# EAGLE schematic Fuel Cell Controller V2 (EAGLE 7.7.0)

## Sheet 1 of 7
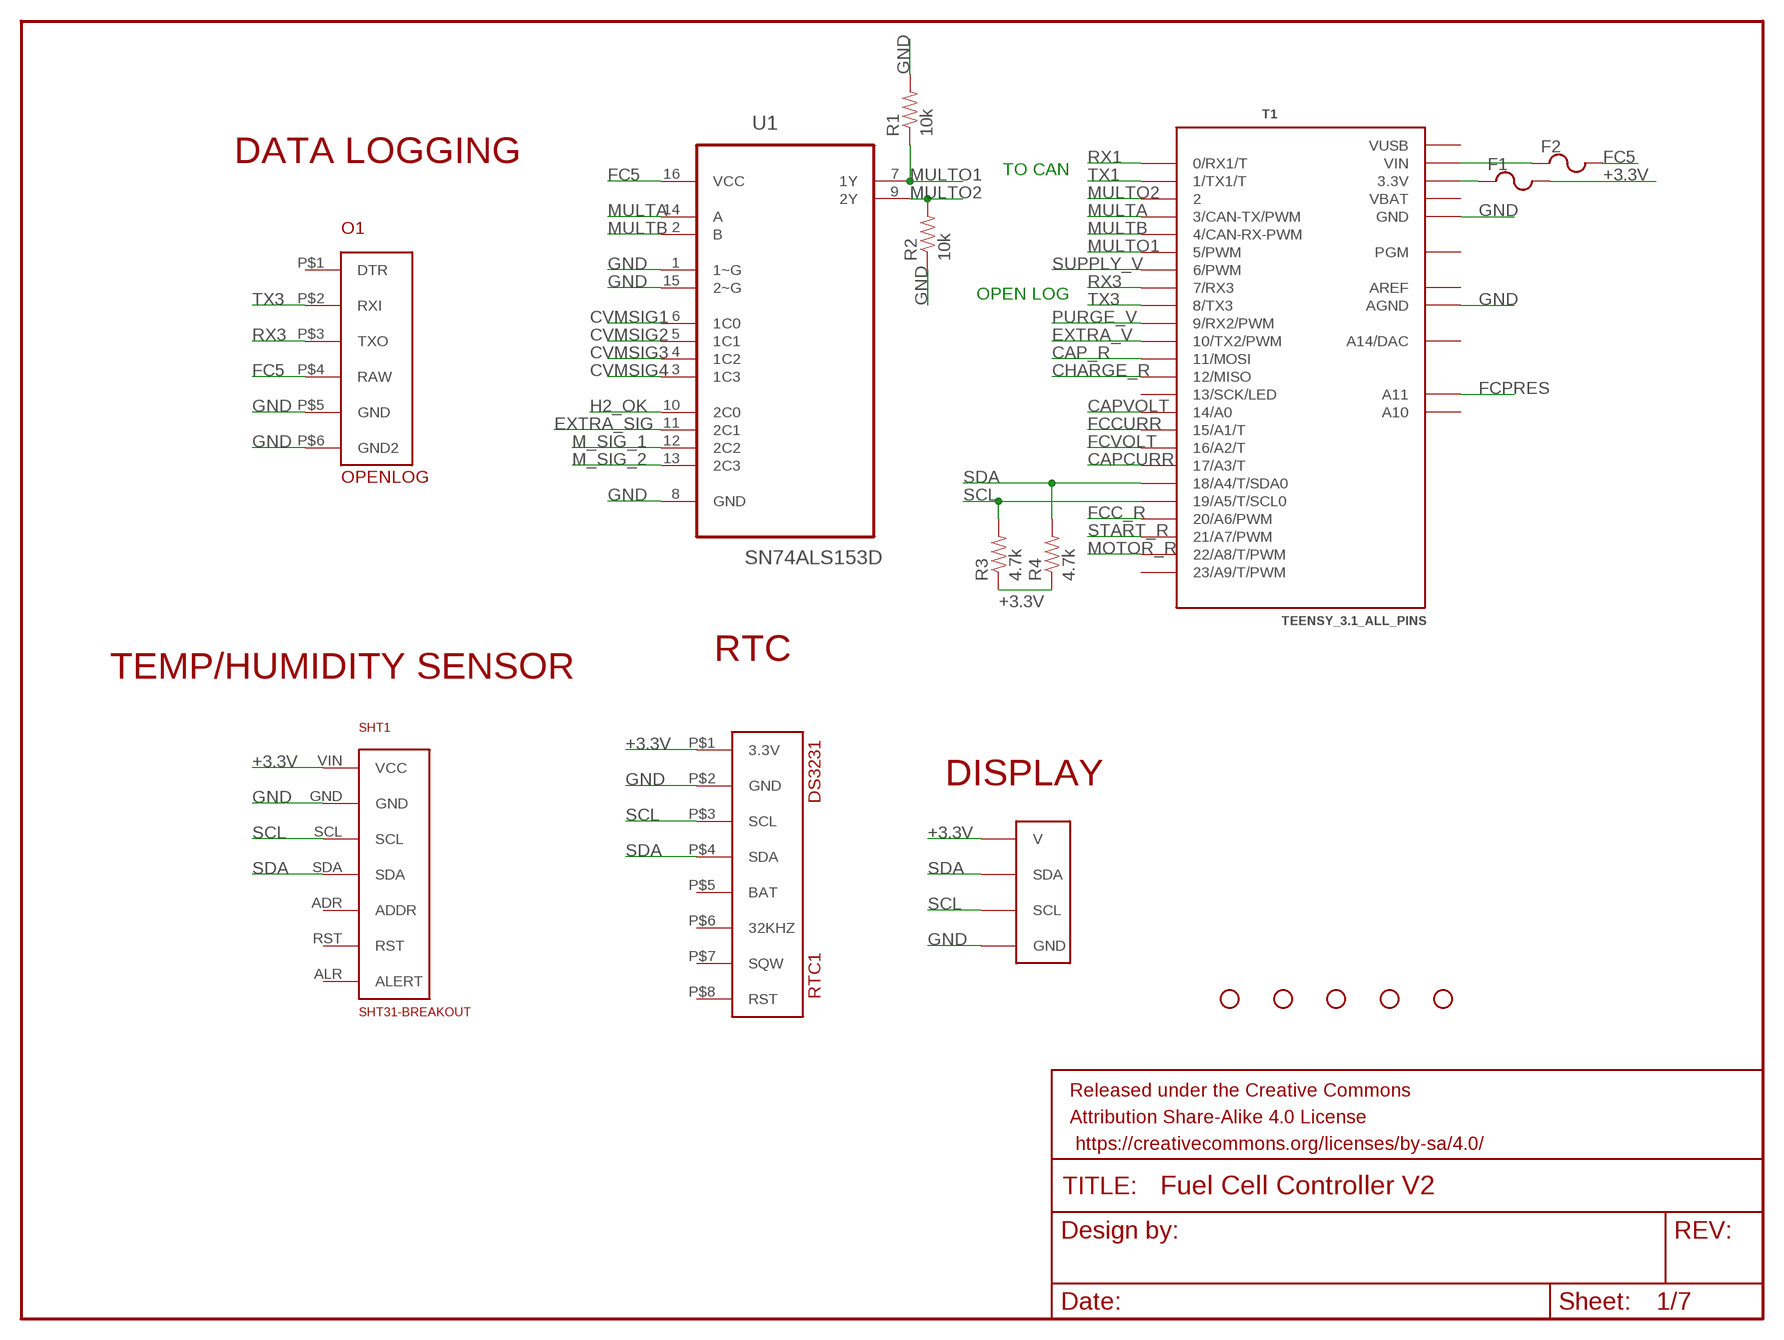
[diagram p0: schematic, sheet 1]

### Parts
F1  POLYFUSE  [1206]
F2  POLYFUSE  [1206]
FRAME1  FRAME-LETTERNO_PACKAGE  [DUMMY]
LCD1  LCD-BOARD  [LCD-BOARD]
O1  OPENLOG  [OPENLOG]
R1  10k  RESISTOR0805-RES  [0805]
R2  10k  RESISTOR0805-RES  [0805]
R3  4.7k  RESISTOR0805-RES  [0805]
R4  4.7k  RESISTOR0805-RES  [0805]
RTC1  DS3231  [DS3231]
SHT1  SHT31-BREAKOUT  [SHT31-BREAKOUT]
STANDOFF1  STAND-OFF  [STAND-OFF]
STANDOFF2  STAND-OFF  [STAND-OFF]
STANDOFF3  STAND-OFF  [STAND-OFF]
STANDOFF4  STAND-OFF  [STAND-OFF]
STANDOFF5  STAND-OFF  [STAND-OFF]
T1  TEENSY_3.1_ALL_PINS  [TEENSY3-ALL_PINS]
U1  SN74ALS153D  [SOIC127P600X175-16N]

### Nets
+3.3V: F1.2 LCD1.V R3.1 R4.1 RTC1.P$1(3.3V) SHT1.VIN(VCC) ; also sheet 2,3,4,5,7
CAP_R: T1.11(11/MOSI) ; also sheet 2
CAPCURR: T1.17/A3(17/A3/T) ; also sheet 2
CAPVOLT: T1.14/A0 ; also sheet 2
CHARGE_R: T1.12(12/MISO) ; also sheet 2
CVMSIG1: U1.6(1C0) ; also sheet 3
CVMSIG2: U1.5(1C1) ; also sheet 3
CVMSIG3: U1.4(1C2) ; also sheet 3
CVMSIG4: U1.3(1C3) ; also sheet 3
EXTRA_SIG: U1.11(2C1) ; also sheet 6
EXTRA_V: T1.10(10/TX2/PWM) ; also sheet 6
FC5: F2.2 O1.P$4(RAW) U1.16(VCC) ; also sheet 2,3,5,6
FCC_R: T1.20/A6(20/A6/PWM) ; also sheet 2
FCCURR: T1.15/A1(15/A1/T) ; also sheet 2
FCPRES: T1.A11 ; also sheet 6
FCVOLT: T1.16/A2(16/A2/T) ; also sheet 2
GND: LCD1.GND1(GND) LCD1.GND2(GND) LCD1.GND3(GND) LCD1.GND4(GND) LCD1.GND5(GND) LCD1.GND6(GND) LCD1.GND7(GND) LCD1.GND8(GND) LCD1.GND9(GND) LCD1.GND10(GND) LCD1.GND11(GND) LCD1.GND12(GND) LCD1.GND13(GND) O1.P$5(GND) O1.P$6(GND2) R1.2 R2.1 RTC1.P$2(GND) SHT1.GND T1.AGND T1.GND T1.GND1(GND) U1.1(1~G) U1.8(GND) U1.15(2~G) ; also sheet 2,3,4,5,6,7
H2_OK: U1.10(2C0) ; also sheet 2,6
M_SIG_1: U1.12(2C2) ; also sheet 4
M_SIG_2: U1.13(2C3) ; also sheet 4
MOTOR_R: T1.22/A8(22/A8/T/PWM) ; also sheet 2
MULTA: T1.3(3/CAN-TX/PWM) U1.14(A)
MULTB: T1.4(4/CAN-RX-PWM) U1.2(B)
MULTO1: R1.1 T1.5(5/PWM) U1.7(1Y)
MULTO2: R2.2 T1.2 U1.9(2Y)
N$23: F2.1 T1.VIN
N$26: F1.1 T1.3.3V T1.3.3V1(3.3V)
PURGE_V: T1.9(9/RX2/PWM) ; also sheet 6
RX1: T1.0(0/RX1/T) ; also sheet 4
RX3: O1.P$3(TXO) T1.7(7/RX3)
SCL: LCD1.SCL R3.2 RTC1.P$3(SCL) SHT1.SCL T1.19/A5(19/A5/T/SCL0) ; also sheet 3,4,6,7
SDA: LCD1.SDA R4.2 RTC1.P$4(SDA) SHT1.SDA T1.18/A4(18/A4/T/SDA0) ; also sheet 3,4,6,7
START_R: T1.21/A7(21/A7/PWM) ; also sheet 2
SUPPLY_V: T1.6(6/PWM) ; also sheet 6
TX1: T1.1(1/TX1/T) ; also sheet 4
TX3: O1.P$2(RXI) T1.8(8/TX3)
Unconnected: O1.P$1(DTR) RTC1.P$5(BAT) RTC1.P$6(32KHZ) RTC1.P$7(SQW) RTC1.P$8(RST) SHT1.ADR(ADDR) SHT1.ALR(ALERT) SHT1.RST T1.13(13/SCK/LED) T1.23/A9(23/A9/T/PWM) T1.A10 T1.PGM T1.RESET/DAC(A14/DAC)

### Notes on the sheet
- DATA LOGGING | TO CAN
- OPEN LOG
- RTC
- TEMP/HUMIDITY SENSOR
- DISPLAY

## Sheet 2 of 7
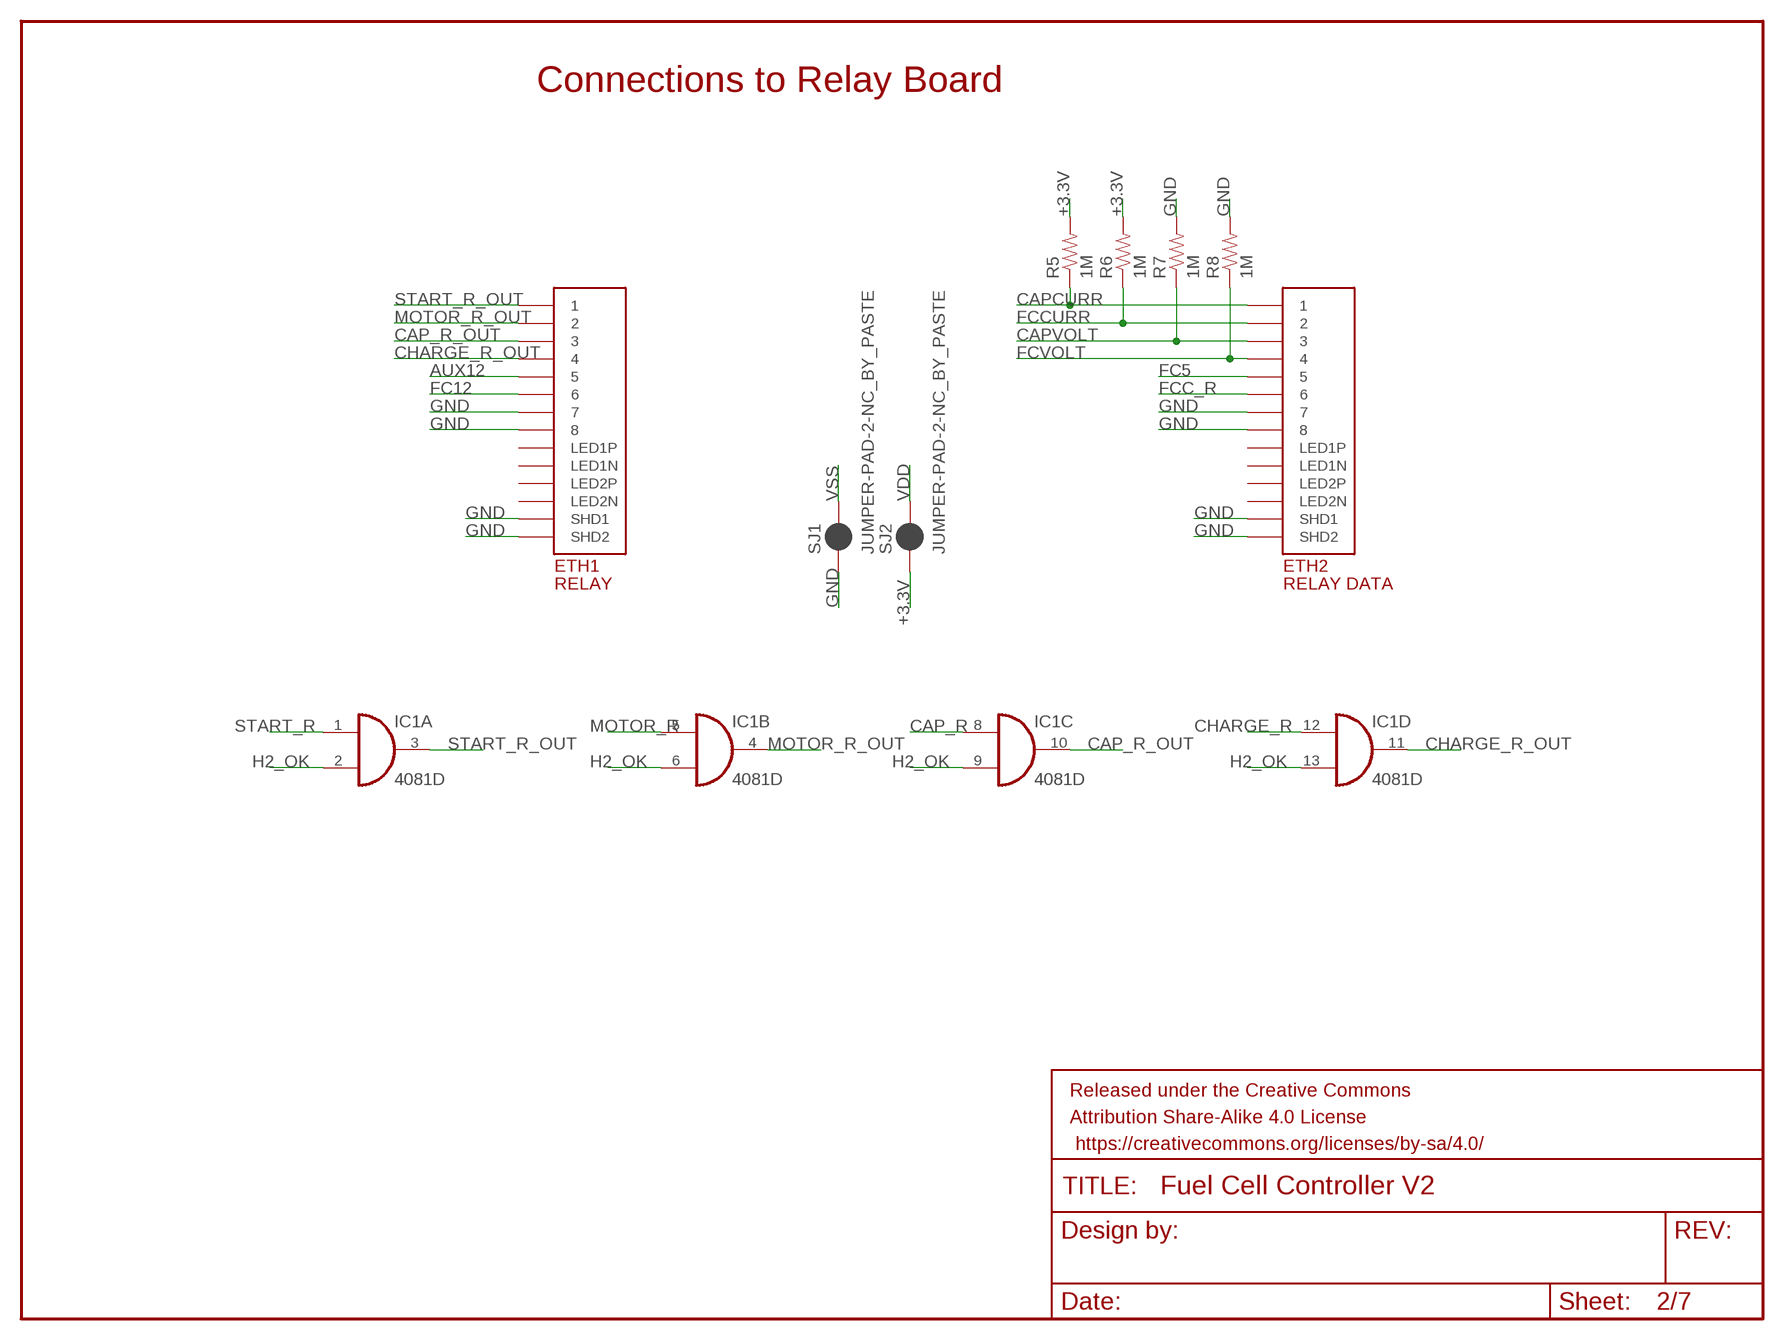
[diagram p1: schematic, sheet 2]

### Parts
ETH1  RELAY  ETHERNET  [A122645-ND]
ETH2  RELAY DATA  ETHERNET  [A122645-ND]
FRAME2  FRAME-LETTERNO_PACKAGE  [DUMMY]
IC1  4081D  [SO14]
R5  1M  RESISTOR0805-RES  [0805]
R6  1M  RESISTOR0805-RES  [0805]
R7  1M  RESISTOR0805-RES  [0805]
R8  1M  RESISTOR0805-RES  [0805]
SJ1  JUMPER-PAD-2-NC_BY_PASTE  [PAD-JUMPER-2-NC_BY_PASTE_YES_SILK]
SJ2  JUMPER-PAD-2-NC_BY_PASTE  [PAD-JUMPER-2-NC_BY_PASTE_YES_SILK]

### Nets
+3.3V: R5.2 R6.2 SJ2.1 ; also sheet 1,3,4,5,7
AUX12: ETH1.P$5 ; also sheet 5,6
CAP_R: IC1.8(C:I0) ; also sheet 1
CAP_R_OUT: ETH1.P$3 IC1.10(C:O)
CAPCURR: ETH2.P$1 R5.1 ; also sheet 1
CAPVOLT: ETH2.P$3 R7.1 ; also sheet 1
CHARGE_R: IC1.12(D:I0) ; also sheet 1
CHARGE_R_OUT: ETH1.P$4 IC1.11(D:O)
FC5: ETH2.P$5 ; also sheet 1,3,5,6
FC12: ETH1.P$6 ; also sheet 5,6
FCC_R: ETH2.P$6 ; also sheet 1
FCCURR: ETH2.P$2 R6.1 ; also sheet 1
FCVOLT: ETH2.P$4 R8.1 ; also sheet 1
GND: ETH1.P$7 ETH1.P$8 ETH1.P$13(SHD1) ETH1.P$14(SHD2) ETH2.P$7 ETH2.P$8 ETH2.P$13(SHD1) ETH2.P$14(SHD2) R7.2 R8.2 SJ1.1 ; also sheet 1,3,4,5,6,7
H2_OK: IC1.2(A:I1) IC1.6(B:I1) IC1.9(C:I1) IC1.13(D:I1) ; also sheet 1,6
MOTOR_R: IC1.5(B:I0) ; also sheet 1
MOTOR_R_OUT: ETH1.P$2 IC1.4(B:O)
START_R: IC1.1(A:I0) ; also sheet 1
START_R_OUT: ETH1.P$1 IC1.3(A:O)
VDD: SJ2.2
VSS: SJ1.2
Unconnected: ETH1.P$9(LED1N) ETH1.P$10(LED1P) ETH1.P$11(LED2N) ETH1.P$12(LED2P) ETH2.P$9(LED1N) ETH2.P$10(LED1P) ETH2.P$11(LED2N) ETH2.P$12(LED2P)

### Notes on the sheet
- Connections to Relay Board

## Sheet 3 of 7
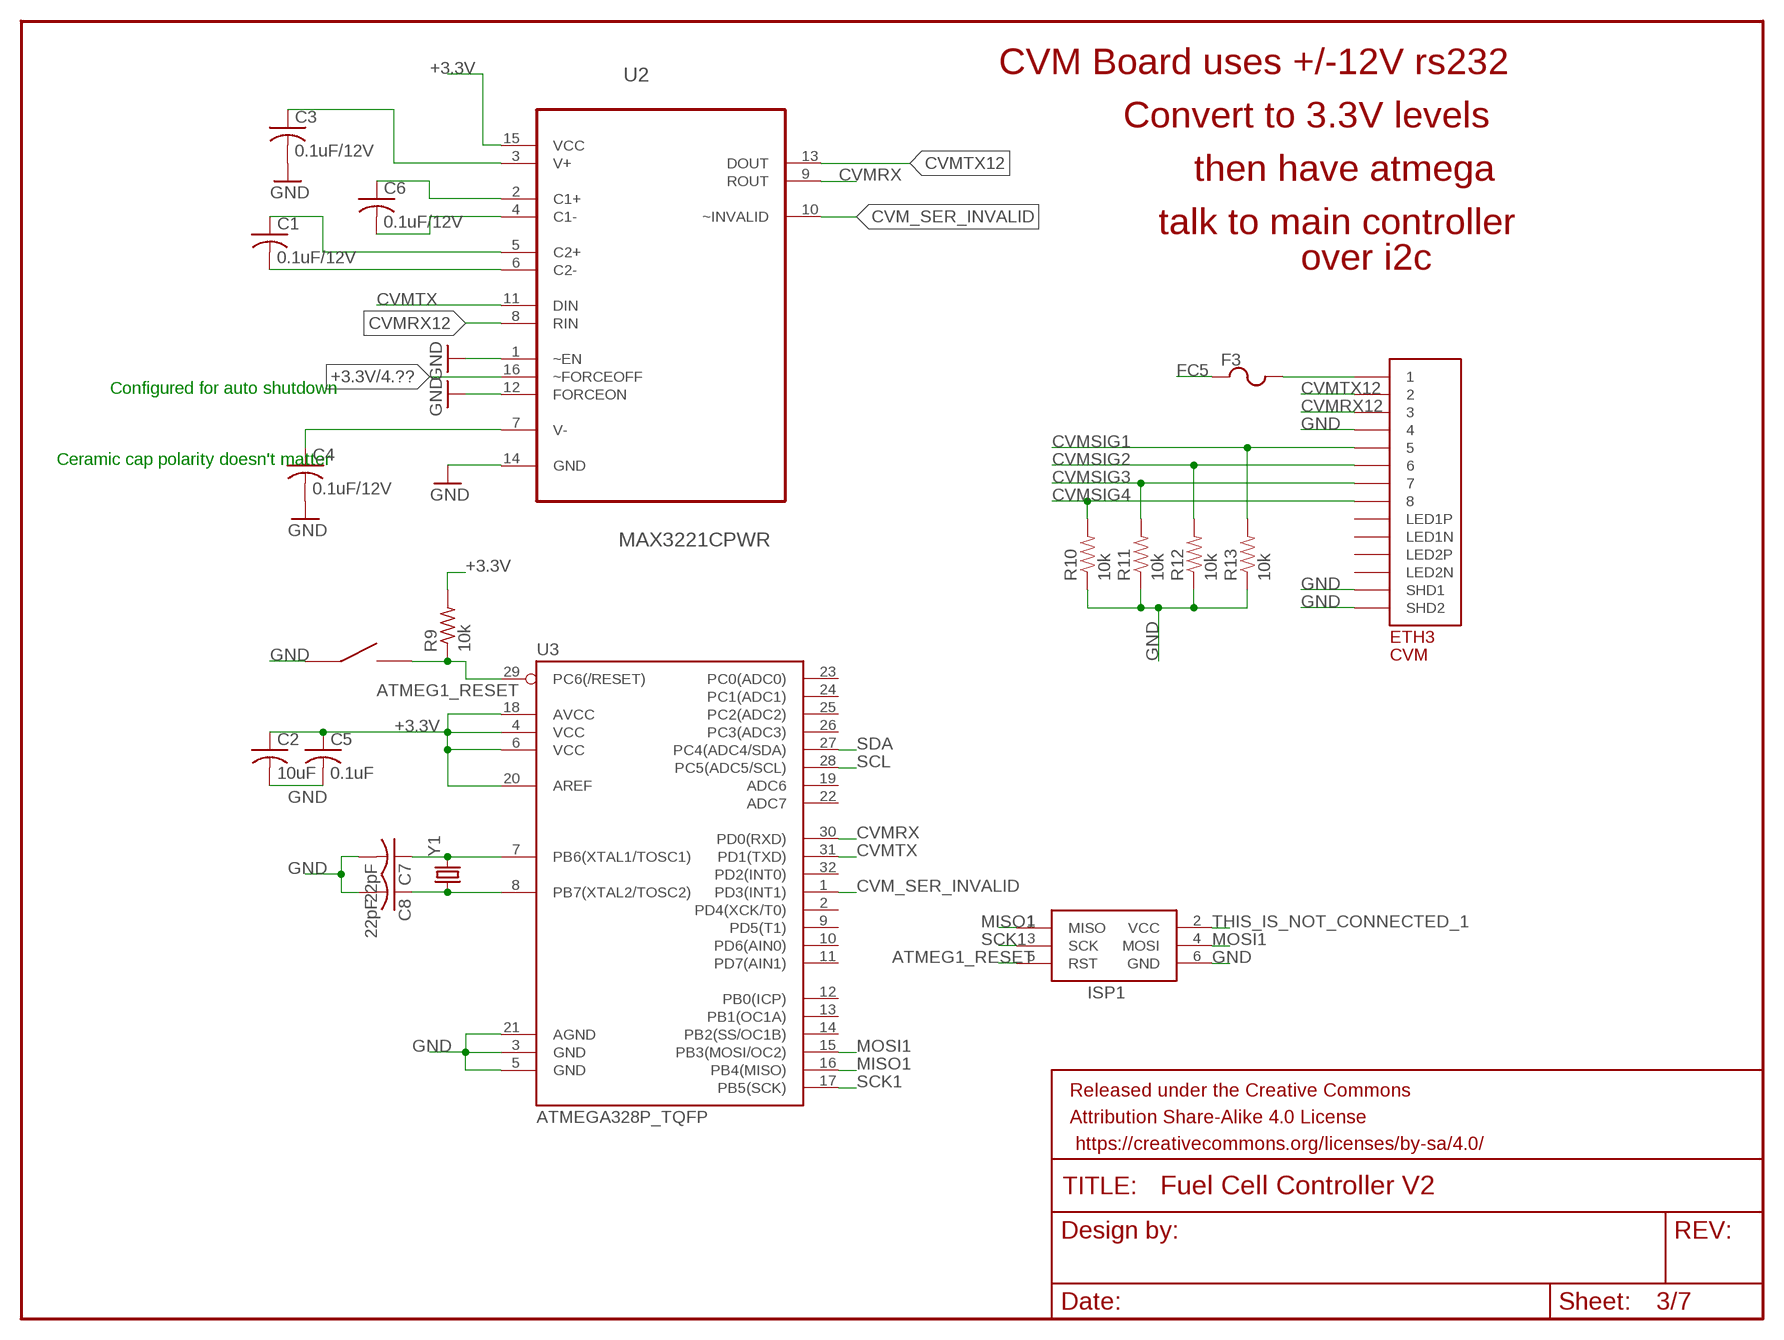
[diagram p2: schematic, sheet 3]

### Parts
C1  0.1uF/12V  C-USC0805  [C0805]
C2  10uF  C-USC0603  [C0603]
C3  0.1uF/12V  C-USC0805  [C0805]
C4  0.1uF/12V  C-USC0805  [C0805]
C5  0.1uF  C-USC0603  [C0603]
C6  0.1uF/12V  C-USC0805  [C0805]
C7  22pF  C-USC0603  [C0603]
C8  22pF  C-USC0603  [C0603]
ETH3  CVM  ETHERNET  [A122645-ND]
F3  POLYFUSE  [1206]
FRAME3  FRAME-LETTERNO_PACKAGE  [DUMMY]
ISP1  AVRISP-BOX  [AVRISP-BOX]
R9  10k  R-US_R0603  [R0603]
R10  10k  RESISTOR0805-RES  [0805]
R11  10k  RESISTOR0805-RES  [0805]
R12  10k  RESISTOR0805-RES  [0805]
R13  10k  RESISTOR0805-RES  [0805]
S1  EG4621CT-ND  [EG4621CT-ND]
U2  MAX3221CPWR  [SOP65P640X120-16N]
U3  ATMEGA328P_TQFP  [TQFP32-08]
Y1  CRYSTALHC49US  [HC49US]

### Nets
+3.3V: C2.1 C5.1 R9.2 U2.15(VCC) U2.16(~FORCEOFF) U3.4(VCC) U3.6(VCC) U3.18(AVCC) U3.20(AREF) ; also sheet 1,2,4,5,7
ATMEG1_RESET: ISP1.5(RST) R9.1 S1.P$3 S1.P$4 U3.29(PC6(/RESET))
CVM_SER_INVALID: U2.10(~INVALID) U3.1(PD3(INT1))
CVMRX: U2.9(ROUT) U3.30(PD0(RXD))
CVMRX12: ETH3.P$3 U2.8(RIN)
CVMSIG1: ETH3.P$5 R13.2 ; also sheet 1
CVMSIG2: ETH3.P$6 R12.2 ; also sheet 1
CVMSIG3: ETH3.P$7 R11.2 ; also sheet 1
CVMSIG4: ETH3.P$8 R10.2 ; also sheet 1
CVMTX: U2.11(DIN) U3.31(PD1(TXD))
CVMTX12: ETH3.P$2 U2.13(DOUT)
FC5: F3.1 ; also sheet 1,2,5,6
GND: C2.2 C3.2 C4.2 C5.2 C7.2 C8.2 ETH3.P$4 ETH3.P$13(SHD1) ETH3.P$14(SHD2) ISP1.6(GND) R10.1 R11.1 R12.1 R13.1 S1.P$1 S1.P$2 U2.1(~EN) U2.12(FORCEON) U2.14(GND) U3.3(GND) U3.5(GND) U3.21(AGND) ; also sheet 1,2,4,5,6,7
MISO1: ISP1.1(MISO) U3.16(PB4(MISO))
MOSI1: ISP1.4(MOSI) U3.15(PB3(MOSI/OC2))
N$4: C7.1 U3.7(PB6(XTAL1/TOSC1)) Y1.2
N$5: C8.1 U3.8(PB7(XTAL2/TOSC2)) Y1.1
N$27: ETH3.P$1 F3.2
N$73: C3.1 U2.3(V+)
N$74: C6.1 U2.2(C1+)
N$75: C6.2 U2.4(C1-)
N$76: C1.1 U2.5(C2+)
N$77: C1.2 U2.6(C2-)
N$78: C4.1 U2.7(V-)
SCK1: ISP1.3(SCK) U3.17(PB5(SCK))
SCL: U3.28(PC5(ADC5/SCL)) ; also sheet 1,4,6,7
SDA: U3.27(PC4(ADC4/SDA)) ; also sheet 1,4,6,7
THIS_IS_NOT_CONNECTED_1: ISP1.2(VCC)
Unconnected: ETH3.P$9(LED1N) ETH3.P$10(LED1P) ETH3.P$11(LED2N) ETH3.P$12(LED2P) U3.2(PD4(XCK/T0)) U3.9(PD5(T1)) U3.10(PD6(AIN0)) U3.11(PD7(AIN1)) U3.12(PB0(ICP)) U3.13(PB1(OC1A)) U3.14(PB2(SS/OC1B)) U3.19(ADC6) U3.22(ADC7) U3.23(PC0(ADC0)) U3.24(PC1(ADC1)) U3.25(PC2(ADC2)) U3.26(PC3(ADC3)) U3.32(PD2(INT0))

### Notes on the sheet
- CVM Board uses +/-12V rs232
- Convert to 3.3V levels
- then have atmega
- talk to main controller
- over i2c
- Configured for auto shutdown
- Ceramic cap polarity doesn't matter

## Sheet 4 of 7
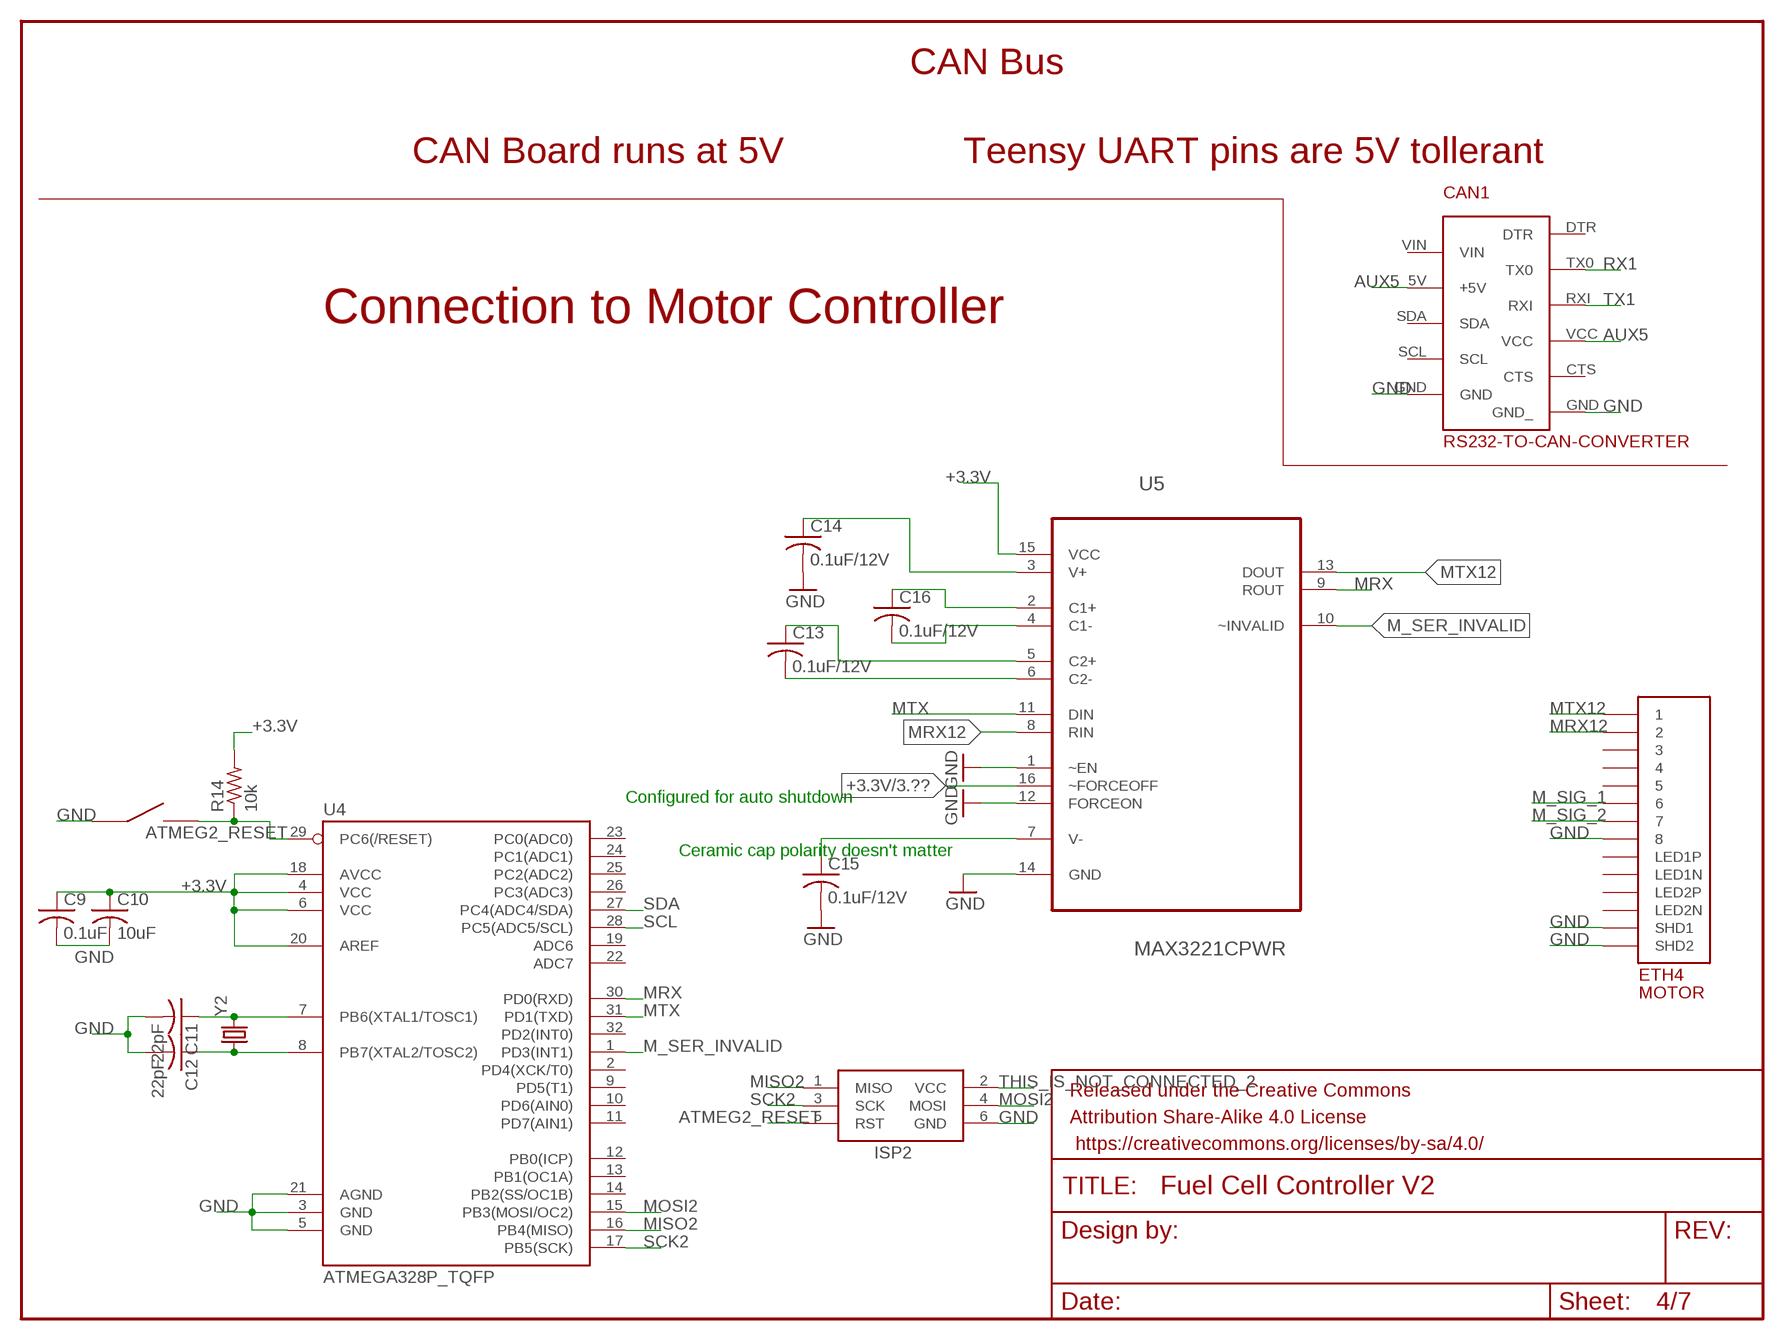
[diagram p3: schematic, sheet 4]

### Parts
C9  0.1uF  C-USC0603  [C0603]
C10  10uF  C-USC0603  [C0603]
C11  22pF  C-USC0603  [C0603]
C12  22pF  C-USC0603  [C0603]
C13  0.1uF/12V  C-USC0805  [C0805]
C14  0.1uF/12V  C-USC0805  [C0805]
C15  0.1uF/12V  C-USC0805  [C0805]
C16  0.1uF/12V  C-USC0805  [C0805]
CAN1  RS232-TO-CAN-CONVERTER  [RS232-TO-CAN-CONVERTER]
ETH4  MOTOR  ETHERNET  [A122645-ND]
FRAME4  FRAME-LETTERNO_PACKAGE  [DUMMY]
ISP2  AVRISP-BOX  [AVRISP-BOX]
R14  10k  R-US_R0603  [R0603]
S2  EG4621CT-ND  [EG4621CT-ND]
U4  ATMEGA328P_TQFP  [TQFP32-08]
U5  MAX3221CPWR  [SOP65P640X120-16N]
Y2  CRYSTALHC49US  [HC49US]

### Nets
+3.3V: C9.1 C10.1 R14.2 U4.4(VCC) U4.6(VCC) U4.18(AVCC) U4.20(AREF) U5.15(VCC) U5.16(~FORCEOFF) ; also sheet 1,2,3,5,7
ATMEG2_RESET: ISP2.5(RST) R14.1 S2.P$3 S2.P$4 U4.29(PC6(/RESET))
AUX5: CAN1.5V(+5V) CAN1.VCC ; also sheet 5,6
GND: C9.2 C10.2 C11.2 C12.2 C14.2 C15.2 CAN1.GND CAN1.GND_ ETH4.P$8 ETH4.P$13(SHD1) ETH4.P$14(SHD2) ISP2.6(GND) S2.P$1 S2.P$2 U4.3(GND) U4.5(GND) U4.21(AGND) U5.1(~EN) U5.12(FORCEON) U5.14(GND) ; also sheet 1,2,3,5,6,7
M_SER_INVALID: U4.1(PD3(INT1)) U5.10(~INVALID)
M_SIG_1: ETH4.P$6 ; also sheet 1
M_SIG_2: ETH4.P$7 ; also sheet 1
MISO2: ISP2.1(MISO) U4.16(PB4(MISO))
MOSI2: ISP2.4(MOSI) U4.15(PB3(MOSI/OC2))
MRX: U4.30(PD0(RXD)) U5.9(ROUT)
MRX12: ETH4.P$2 U5.8(RIN)
MTX: U4.31(PD1(TXD)) U5.11(DIN)
MTX12: ETH4.P$1 U5.13(DOUT)
N$1: C11.1 U4.7(PB6(XTAL1/TOSC1)) Y2.2
N$2: C12.1 U4.8(PB7(XTAL2/TOSC2)) Y2.1
N$3: C14.1 U5.3(V+)
N$6: C16.1 U5.2(C1+)
N$7: C16.2 U5.4(C1-)
N$8: C13.1 U5.5(C2+)
N$9: C13.2 U5.6(C2-)
N$10: C15.1 U5.7(V-)
RX1: CAN1.TX0 ; also sheet 1
SCK2: ISP2.3(SCK) U4.17(PB5(SCK))
SCL: U4.28(PC5(ADC5/SCL)) ; also sheet 1,3,6,7
SDA: U4.27(PC4(ADC4/SDA)) ; also sheet 1,3,6,7
THIS_IS_NOT_CONNECTED_2: ISP2.2(VCC)
TX1: CAN1.RXI ; also sheet 1
Unconnected: CAN1.CTS CAN1.DTR CAN1.SCL CAN1.SDA CAN1.VIN ETH4.P$3 ETH4.P$4 ETH4.P$5 ETH4.P$9(LED1N) ETH4.P$10(LED1P) ETH4.P$11(LED2N) ETH4.P$12(LED2P) U4.2(PD4(XCK/T0)) U4.9(PD5(T1)) U4.10(PD6(AIN0)) U4.11(PD7(AIN1)) U4.12(PB0(ICP)) U4.13(PB1(OC1A)) U4.14(PB2(SS/OC1B)) U4.19(ADC6) U4.22(ADC7) U4.23(PC0(ADC0)) U4.24(PC1(ADC1)) U4.25(PC2(ADC2)) U4.26(PC3(ADC3)) U4.32(PD2(INT0))

### Notes on the sheet
- CAN Bus
- CAN Board runs at 5V | Teensy UART pins are 5V tollerant
- Connection to Motor Controller
- Configured for auto shutdown
- Ceramic cap polarity doesn't matter

## Sheet 5 of 7
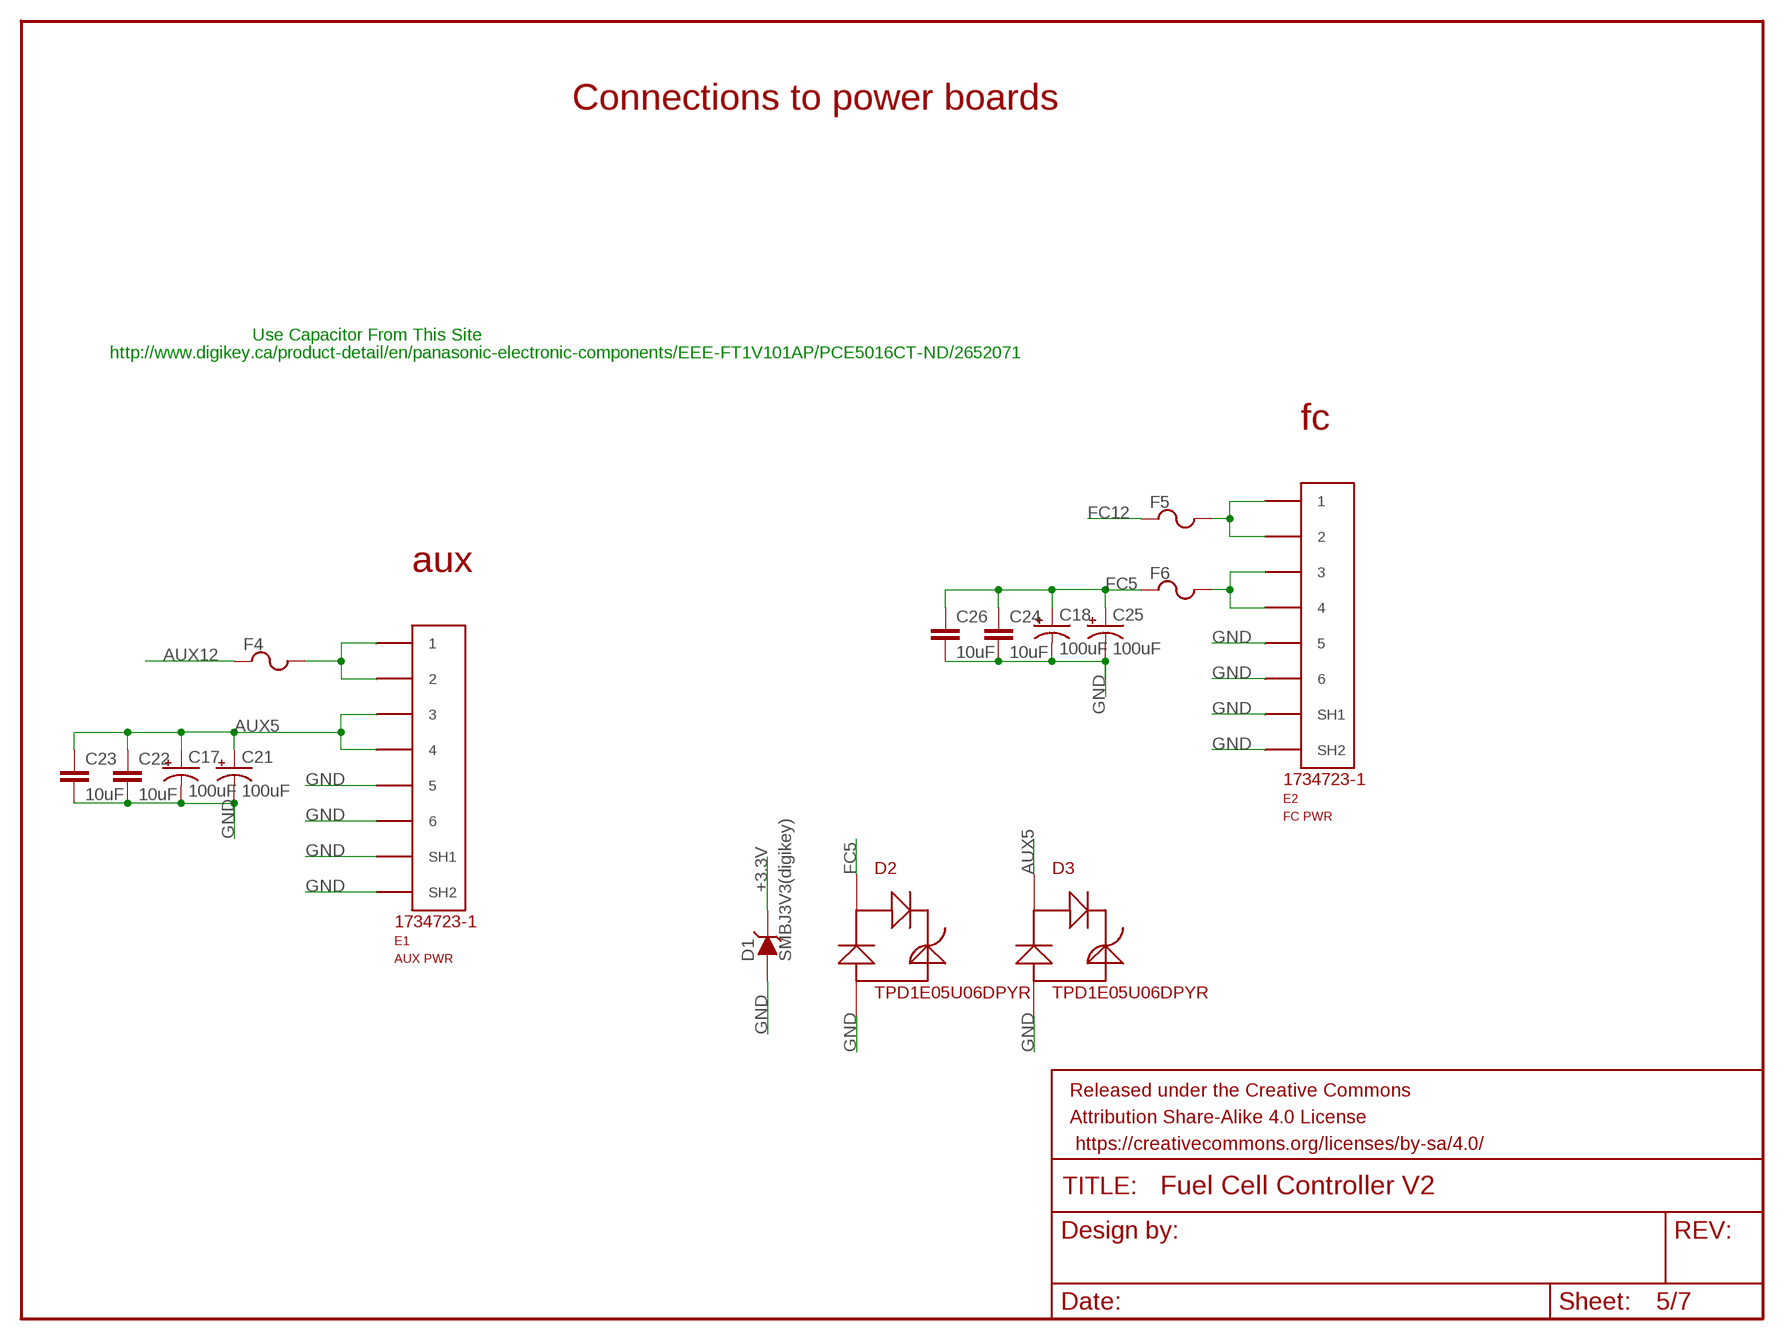
[diagram p4: schematic, sheet 5]

### Parts
C17  100uF  CAP_POLD  [PANASONIC_D]
C18  100uF  CAP_POLD  [PANASONIC_D]
C21  100uF  CAP_POLD  [PANASONIC_D]
C22  10uF  CAP0805  [0805]
C23  10uF  CAP0805  [0805]
C24  10uF  CAP0805  [0805]
C25  100uF  CAP_POLD  [PANASONIC_D]
C26  10uF  CAP0805  [0805]
D1  SMBJ3V3(digikey)  5KASMC  [DO-214AB]
D2  TPD1E05U06DPYR  [2-XDFN]
D3  TPD1E05U06DPYR  [2-XDFN]
E1  AUX PWR  5555140-6  [1734723-1_RJ11]
E2  FC PWR  5555140-6  [1734723-1_RJ11]
F4  POLYFUSE  [1206]
F5  POLYFUSE  [1206]
F6  POLYFUSE  [1206]
FRAME5  FRAME-LETTERNO_PACKAGE  [DUMMY]

### Nets
+3.3V: D1.C ; also sheet 1,2,3,4,7
AUX5: C17.+ C21.+ C22.1 C23.1 D3.P$1 E1.3 E1.4 ; also sheet 4,6
AUX12: F4.1 ; also sheet 2,6
FC5: C18.+ C24.1 C25.+ C26.1 D2.P$1 F6.1 ; also sheet 1,2,3,6
FC12: F5.1 ; also sheet 2,6
GND: C17.- C18.- C21.- C22.2 C23.2 C24.2 C25.- C26.2 D1.A D2.P$2 D3.P$2 E1.5 E1.6 E1.SH1 E1.SH2 E2.5 E2.6 E2.SH1 E2.SH2 ; also sheet 1,2,3,4,6,7
N$15: E1.1 E1.2 F4.2
N$24: E2.1 E2.2 F5.2
N$25: E2.3 E2.4 F6.2

### Notes on the sheet
- Connections to power boards
- Use Capacitor From This Site
- http://www.digikey.ca/product-detail/en/panasonic-electronic-components/EEE-FT1V101AP/PCE5016CT-ND/2652071
- fc
- aux

## Sheet 6 of 7
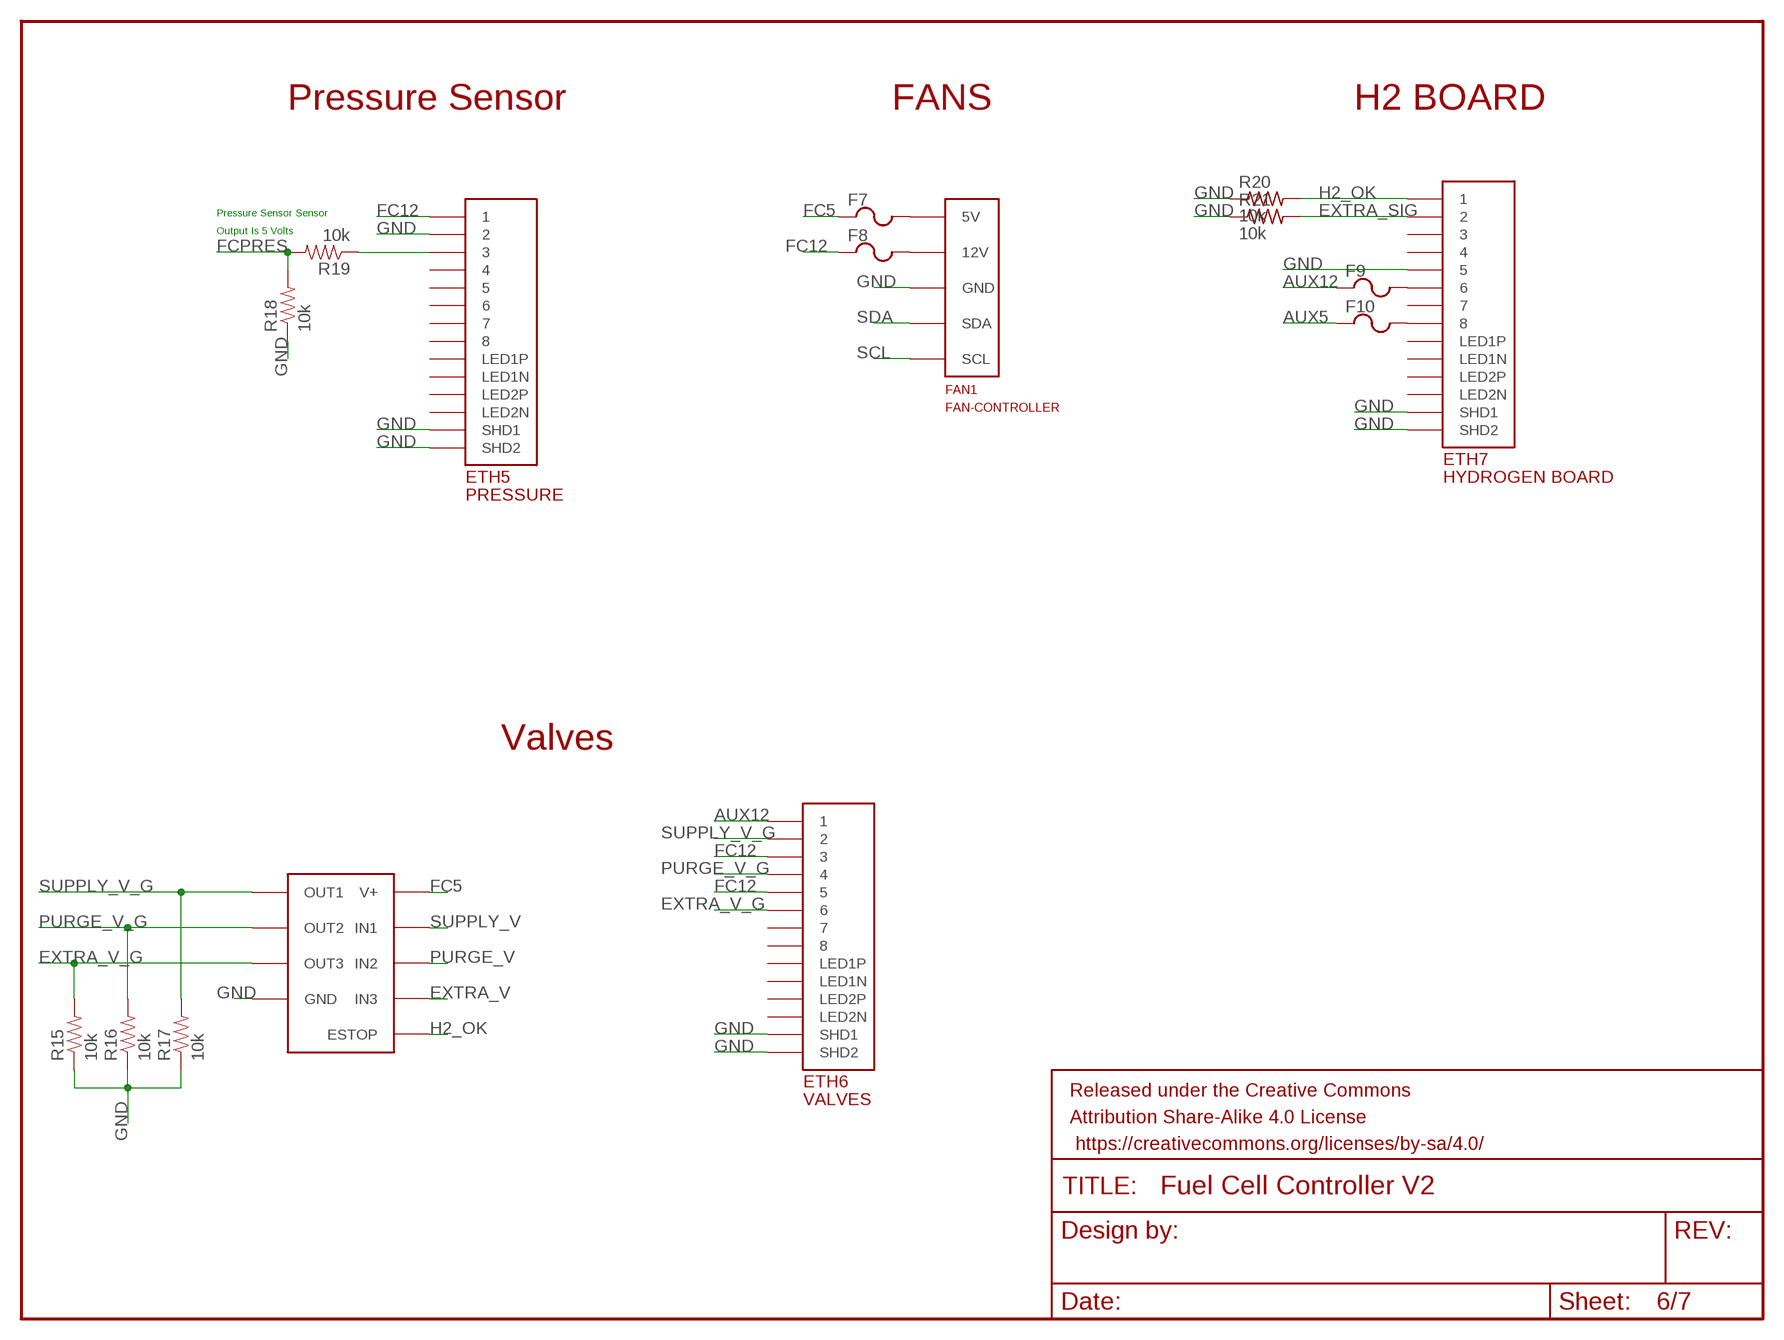
[diagram p5: schematic, sheet 6]

### Parts
ETH5  PRESSURE  ETHERNET  [A122645-ND]
ETH6  VALVES  ETHERNET  [A122645-ND]
ETH7  HYDROGEN BOARD  ETHERNET  [A122645-ND]
F7  POLYFUSE  [1206]
F8  POLYFUSE  [1206]
F9  POLYFUSE  [1206]
F10  POLYFUSE  [1206]
FAN1  FAN-CONTROLLER  [FAN-CONTROLLER]
FRAME6  FRAME-LETTERNO_PACKAGE  [DUMMY]
M1  MOSFETBOARD  [MOSFET-BOARD]
R15  10k  RESISTOR0805-RES  [0805]
R16  10k  RESISTOR0805-RES  [0805]
R17  10k  RESISTOR0805-RES  [0805]
R18  10k  RESISTOR0805-RES  [0805]
R19  10k  RESISTOR0805-RES  [0805]
R20  10k  R-US_R0603  [R0603]
R21  10k  R-US_R0603  [R0603]

### Nets
AUX5: F10.1 ; also sheet 4,5
AUX12: ETH6.P$1 F9.1 ; also sheet 2,5
EXTRA_SIG: ETH7.P$2 R21.2 ; also sheet 1
EXTRA_V: M1.IN3 ; also sheet 1
EXTRA_V_G: ETH6.P$6 M1.OUT3 R15.2
FC5: F7.1 M1.VDD(V+) ; also sheet 1,2,3,5
FC12: ETH5.P$1 ETH6.P$3 ETH6.P$5 F8.1 ; also sheet 2,5
FCPRES: R18.2 R19.2 ; also sheet 1
GND: ETH5.P$2 ETH5.P$13(SHD1) ETH5.P$14(SHD2) ETH6.P$13(SHD1) ETH6.P$14(SHD2) ETH7.P$5 ETH7.P$13(SHD1) ETH7.P$14(SHD2) FAN1.GND FAN1.GND2(GND) FAN1.GND3(GND) M1.GND M1.GND1(GND) M1.GND2(GND) M1.VSS(GND) R15.1 R16.1 R17.1 R18.1 R20.1 R21.1 ; also sheet 1,2,3,4,5,7
H2_OK: ETH7.P$1 M1.ESTOP R20.2 ; also sheet 1,2
N$11: ETH7.P$6 F9.2
N$12: ETH7.P$8 F10.2
N$13: F7.2 FAN1.5(5V) FAN1.5_2(5V)
N$14: F8.2 FAN1.12(12V) FAN1.12_2(12V) FAN1.12_3(12V)
N$46: ETH5.P$3 R19.1
PURGE_V: M1.IN2 ; also sheet 1
PURGE_V_G: ETH6.P$4 M1.OUT2 R16.2
SCL: FAN1.SCL ; also sheet 1,3,4,7
SDA: FAN1.SDA ; also sheet 1,3,4,7
SUPPLY_V: M1.IN1 ; also sheet 1
SUPPLY_V_G: ETH6.P$2 M1.OUT1 R17.2
Unconnected: ETH5.P$4 ETH5.P$5 ETH5.P$6 ETH5.P$7 ETH5.P$8 ETH5.P$9(LED1N) ETH5.P$10(LED1P) ETH5.P$11(LED2N) ETH5.P$12(LED2P) ETH6.P$7 ETH6.P$8 ETH6.P$9(LED1N) ETH6.P$10(LED1P) ETH6.P$11(LED2N) ETH6.P$12(LED2P) ETH7.P$3 ETH7.P$4 ETH7.P$7 ETH7.P$9(LED1N) ETH7.P$10(LED1P) ETH7.P$11(LED2N) ETH7.P$12(LED2P)

### Notes on the sheet
- Pressure Sensor | FANS | H2 BOARD
- Pressure Sensor Sensor
- Output Is 5 Volts
- Valves

## Sheet 7 of 7
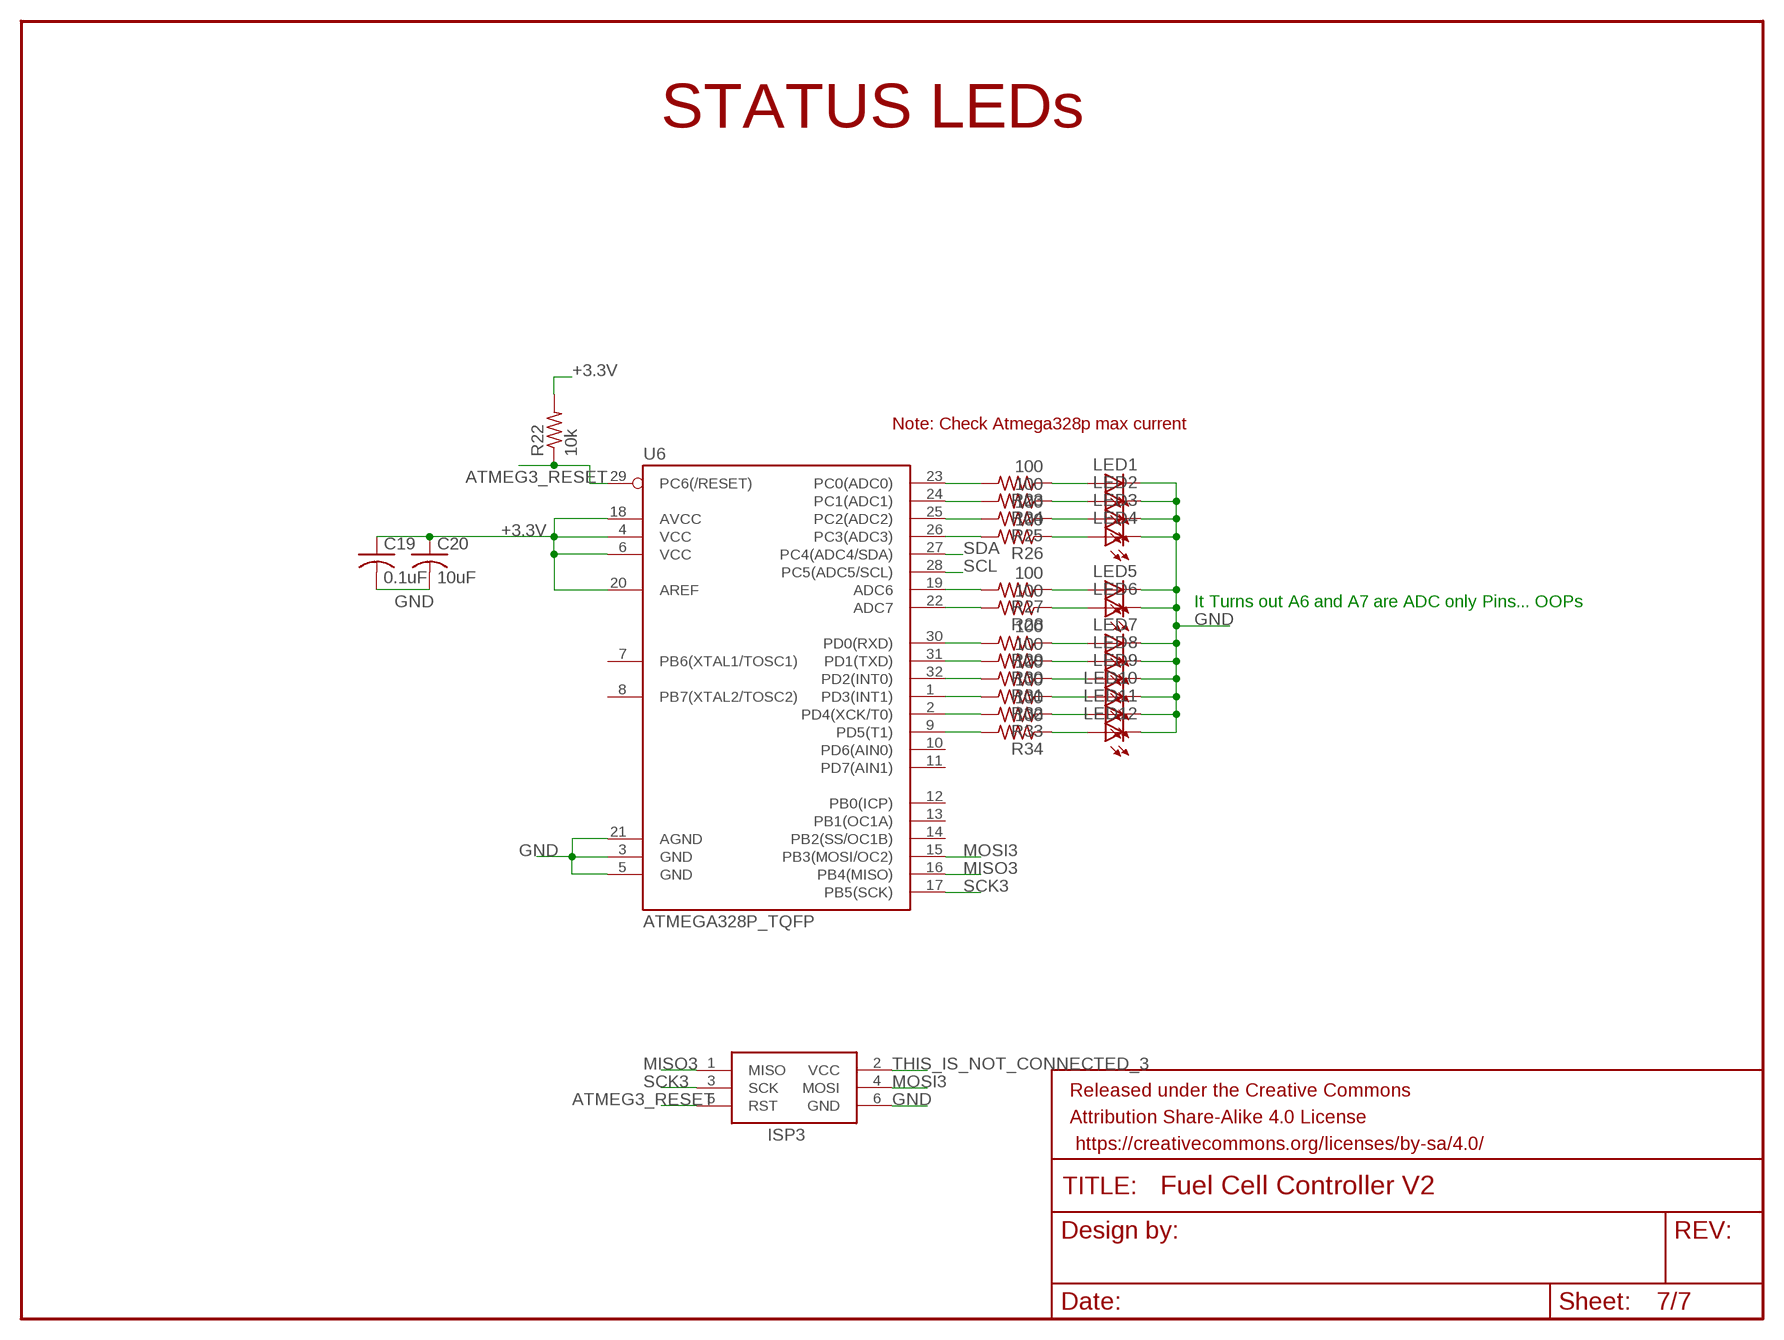
[diagram p6: schematic, sheet 7]

### Parts
C19  0.1uF  C-USC0603  [C0603]
C20  10uF  C-USC0603  [C0603]
FRAME7  FRAME-LETTERNO_PACKAGE  [DUMMY]
ISP3  AVRISP-BOX  [AVRISP-BOX]
LED1  LEDCHIPLED_0805  [CHIPLED_0805]
LED2  LEDCHIPLED_0805  [CHIPLED_0805]
LED3  LEDCHIPLED_0805  [CHIPLED_0805]
LED4  LEDCHIPLED_0805  [CHIPLED_0805]
LED5  LEDCHIPLED_0805  [CHIPLED_0805]
LED6  LEDCHIPLED_0805  [CHIPLED_0805]
LED7  LEDCHIPLED_0805  [CHIPLED_0805]
LED8  LEDCHIPLED_0805  [CHIPLED_0805]
LED9  LEDCHIPLED_0805  [CHIPLED_0805]
LED10  LEDCHIPLED_0805  [CHIPLED_0805]
LED11  LEDCHIPLED_0805  [CHIPLED_0805]
LED12  LEDCHIPLED_0805  [CHIPLED_0805]
R22  10k  R-US_R0603  [R0603]
R23  100  R-US_R0603  [R0603]
R24  100  R-US_R0603  [R0603]
R25  100  R-US_R0603  [R0603]
R26  100  R-US_R0603  [R0603]
R27  100  R-US_R0603  [R0603]
R28  100  R-US_R0603  [R0603]
R29  100  R-US_R0603  [R0603]
R30  100  R-US_R0603  [R0603]
R31  100  R-US_R0603  [R0603]
R32  100  R-US_R0603  [R0603]
R33  100  R-US_R0603  [R0603]
R34  100  R-US_R0603  [R0603]
U6  ATMEGA328P_TQFP  [TQFP32-08]

### Nets
+3.3V: C19.1 C20.1 R22.2 U6.4(VCC) U6.6(VCC) U6.18(AVCC) U6.20(AREF) ; also sheet 1,2,3,4,5
ATMEG3_RESET: ISP3.5(RST) R22.1 U6.29(PC6(/RESET))
GND: C19.2 C20.2 ISP3.6(GND) LED1.C LED2.C LED3.C LED4.C LED5.C LED6.C LED7.C LED8.C LED9.C LED10.C LED11.C LED12.C U6.3(GND) U6.5(GND) U6.21(AGND) ; also sheet 1,2,3,4,5,6
MISO3: ISP3.1(MISO) U6.16(PB4(MISO))
MOSI3: ISP3.4(MOSI) U6.15(PB3(MOSI/OC2))
N$16: R23.2 U6.23(PC0(ADC0))
N$18: R24.2 U6.24(PC1(ADC1))
N$19: R25.2 U6.25(PC2(ADC2))
N$20: R26.2 U6.26(PC3(ADC3))
N$21: R27.2 U6.19(ADC6)
N$22: R28.2 U6.22(ADC7)
N$28: R29.2 U6.30(PD0(RXD))
N$29: R30.2 U6.31(PD1(TXD))
N$30: R31.2 U6.32(PD2(INT0))
N$31: R32.2 U6.1(PD3(INT1))
N$32: R33.2 U6.2(PD4(XCK/T0))
N$33: R34.2 U6.9(PD5(T1))
N$34: LED12.A R34.1
N$35: LED11.A R33.1
N$36: LED10.A R32.1
N$37: LED9.A R31.1
N$38: LED8.A R30.1
N$39: LED7.A R29.1
N$40: LED6.A R28.1
N$41: LED5.A R27.1
N$42: LED4.A R26.1
N$43: LED3.A R25.1
N$44: LED2.A R24.1
N$45: LED1.A R23.1
SCK3: ISP3.3(SCK) U6.17(PB5(SCK))
SCL: U6.28(PC5(ADC5/SCL)) ; also sheet 1,3,4,6
SDA: U6.27(PC4(ADC4/SDA)) ; also sheet 1,3,4,6
THIS_IS_NOT_CONNECTED_3: ISP3.2(VCC)
Unconnected: U6.7(PB6(XTAL1/TOSC1)) U6.8(PB7(XTAL2/TOSC2)) U6.10(PD6(AIN0)) U6.11(PD7(AIN1)) U6.12(PB0(ICP)) U6.13(PB1(OC1A)) U6.14(PB2(SS/OC1B))

### Notes on the sheet
- STATUS LEDs
- Note: Check Atmega328p max current
- It Turns out A6 and A7 are ADC only Pins... OOPs

## Power pins joined to a net without a drawn wire
AREF: T1.AREF
VBAT: T1.VBAT
VDD: IC1.14(P:VDD)
VSS: IC1.7(P:VSS)
VUSB: T1.VUSB

## Library data of the parts
C1 C3 C4 C6 C13-C16 = E-P-008-R1.2:C-US: CAPACITOR, American symbol
C2 C5 C7-C12 C19 C20 = adafruit:C-US: CAPACITOR, American symbol
C17 C18 C21 C25 = SparkFun-Capacitors:CAP_POL: Capacitor Polarized These are standard SMD and PTH capacitors. Normally 10uF, 47uF, and 100uF in electrolytic and tantalum varieties. Always verify the external diameter of the through hole cap, it varies with capacity, voltage, and manufacturer. The EIA devices should be standard.
C22-C24 C26 = SparkFun-Capacitors-extra:CAP: Capacitor Standard 0603 ceramic capacitor, and 0.1" leaded capacitor.
CAN1 = rs232-to-can:RS232-TO-CAN-CONVERTER
D1 = bt_diode:5KA: 5KASMC TVS Diode Surface mount PAR® Transient Voltage Suppressors with high temperature stability and high reliability conditions. Junction passivation optimized design passivated anisotropic rectifier technology. TJ = 185 °C capability suitable for high reliability and automotive requirement. AEC-Q101 qualified. PPPM=5000W Vishay General Semiconductor datasheet.pdf <http://www.vishay.com/docs/89432/5kasmc.pdf>
D2 D3 = TPD1E05U06DPYR:TPD1E05U06DPYR: 5V general purpose TVS diode for ESD protection
E1 E2 = 5555140-6 RJ11:5555140-6
ETH1-ETH7 = ETHERNET:ETHERNET: Ethernet port with 2 leds. digikey number A122645-ND
F1-F10 = polyfuse:POLYFUSE: Resistor Basic schematic elements and footprints for 0603, 1206, and PTH resistors.
FAN1 = fan controller:FAN-CONTROLLER
FRAME1 = SparkFun-Aesthetics:FRAME-LETTER: Schematic Frame Standard 8.5x11 US Letter frame; DESIGNER: Reegan McAllister; VERSION: v01
FRAME2-FRAME7 = SparkFun-Aesthetics:FRAME-LETTER: Schematic Frame Standard 8.5x11 US Letter frame; DESIGNER: Nobody; VERSION: v01
IC1 = 40xx:4081: Quad 2-input AND
ISP1-ISP3 = adafruit:AVRISP: AVR ISP HEADER Standard 6 pin header for AVR programming
LCD1 = lcd board:LCD-BOARD
LED1-LED12 = adafruit:LED: LED OSRAM: - CHIPLED LG R971, LG N971, LY N971, LG Q971, LY Q971, LO R971, LY R971 LH N974, LH R974 LS Q976, LO Q976, LY Q976 LO Q996 - Hyper CHIPLED LW Q18S LB Q993, LB Q99A, LB R99A - SideLED LS A670, LO A670, LY A670, LG A670, LP A670 LB A673, LV A673, LT A673, LW A673 LH A674 LY A675 LS A676, LA A676, LO A676, LY A676, LW A676 LS A679, LY A679, LG A679 - Hyper Micro SIDELED® LS Y876, LA Y876, LO Y876, LY Y876 LT Y87S - SmartLED LW L88C, LW L88S LB L89C, LB L89S, LG L890 LS L89K, LO L89K, LY L89K LS L896, LA L896, LO L896, LY L896 - TOPLED LS T670, LO T670, LY T670, LG T670, LP T670 LSG T670, LSP T670, LSY T670, LOP T670, LYG T670 LG T671, LOG T671, LSG T671 LB T673, LV T673, LT T673, LW T673 LH T674 LS T676, LA T676, LO T676, LY T676, LB T676, LH T676, LSB T676, LW T676 LB T67C, LV T67C, LT T67C, LS T67K, LO T67K, LY T67K, LW E67C LS E67B, LA E67B, LO E67B, LY E67B, LB E67C, LV E67C, LT E67C LW T67C LS T679, LY T679, LG T679 LS T770, LO T770, LY T770, LG T770, LP T770 LB T773, LV T773, LT T773, LW T773 LH T774 LS E675, LA E675, LY E675, LS T675 LS T776, LA T776, LO T776, LY T776, LB T776 LHGB T686 LT T68C, LB T68C - Hyper Mini TOPLED® LB M676 - Mini TOPLED Santana® LG M470 LS M47K, LO M47K, LY M47K Source: http://www.osram.convergy.de/
M1 = mosfet board:MOSFETBOARD
O1 = openlog:OPENLOG
R1-R8 R10-R13 R15-R19 = SparkFun-Resistors:RESISTOR: Resistor Basic schematic elements and footprints for 0603, 1206, and PTH resistors.
R9 R14 R20-R34 = adafruit:R-US_: RESISTOR, American symbol
RTC1 = DS3231:DS3231
S1 S2 = EG4621CT-ND:EG4621CT-ND: surface mount push putton digikey number EG4621CT-ND
SHT1 = SHT31Breakout:SHT31-BREAKOUT
SJ1 SJ2 = SparkFun-Passives:JUMPER-PAD-2-NC_BY_PASTE
STANDOFF1-STANDOFF5 = SparkFun-Electromechanical:STAND-OFF: #4 Stand Off This is the mechanical footprint for a #4 phillips button head screw. Use the keepout ring to avoid running the screw head into surrounding components. SKU : PRT-00447
T1 = Teensy_3_and_LC_Series_Boards_v1.1:TEENSY_3.1_ALL_PINS: Footprint for Teensy 3.1 or 3.2 board using all through-holes, i.e. the entire perimeter plus the 4 through-holes inboard (A10,A11,AREF, VUSB)
U1 = Texas Instruments_By_element14_Batch_1:SN74ALS153D: IC DUAL 1-4 SELECTOR/MUX; MPN: SN74ALS153D; OC_FARNELL: 1752876; OC_NEWARK: 50R5955; PACKAGE: 16-SOIC; SUPPLIER: Texas Instruments
U2 U5 = Texas Instruments_By_element14_Batch_1:MAX3221CPWR: RS-232 Line Driver/Receiver; MPN: MAX3221CPWR; OC_FARNELL: -; OC_NEWARK: 75C0980; PACKAGE: TSSOP-16; SUPPLIER: Texas Instruments
U3 U4 U6 = SparkFun-DigitalIC:ATMEGA328P_TQFP; PROD_ID: IC-09069
Y1 Y2 = SparkFun-FreqCtrl:CRYSTAL: Various standard crystals. Proven footprints.